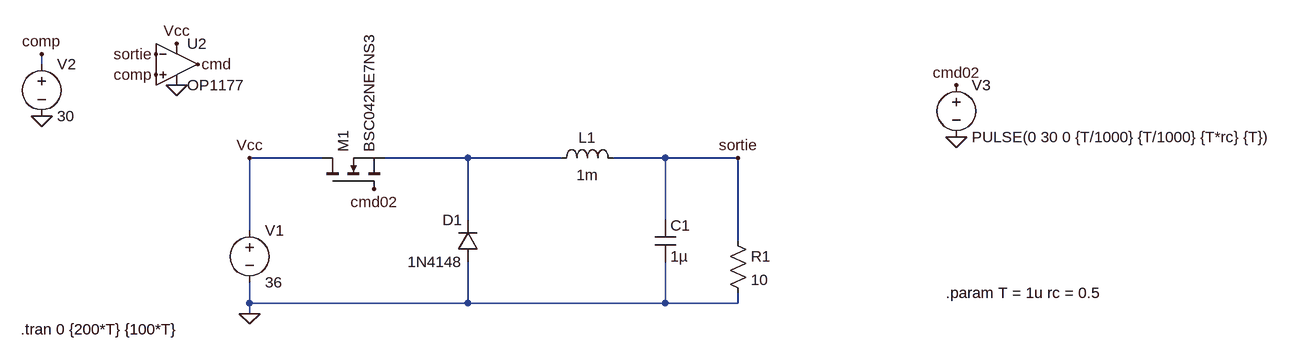
[diagram p0: schematic buckV1.asc]
buckV1.asc, the LTspice schematic file:
Version 4
SHEET 1 1964 680
WIRE -256 -192 -256 -208
WIRE 176 -48 64 -48
WIRE 400 -48 272 -48
WIRE 544 -48 400 -48
WIRE 704 -48 624 -48
WIRE 816 -48 704 -48
WIRE 400 48 400 -48
WIRE 704 48 704 -48
WIRE 64 64 64 -48
WIRE 816 80 816 -48
WIRE 64 176 64 144
WIRE 400 176 400 112
WIRE 400 176 64 176
WIRE 704 176 704 112
WIRE 704 176 400 176
WIRE 816 176 816 160
WIRE 816 176 704 176
WIRE 64 192 64 176
FLAG 64 192 0
FLAG -16 -192 cmd
FLAG 256 0 cmd02
FLAG -80 -208 sortie
FLAG 816 -48 sortie
FLAG 64 -48 Vcc
FLAG -48 -224 Vcc
FLAG -48 -160 0
FLAG -256 -112 0
FLAG -256 -208 comp
FLAG -80 -176 comp
FLAG 1152 -160 cmd02
FLAG 1152 -80 0
SYMBOL voltage 64 48 R0
SYMATTR InstName V1
SYMATTR Value 36
SYMBOL nmos 176 0 R270
SYMATTR InstName M1
SYMATTR Value BSC042NE7NS3
SYMBOL diode 416 112 R180
WINDOW 0 24 64 Left 2
WINDOW 3 24 0 Left 2
SYMATTR InstName D1
SYMATTR Value 1N4148
SYMBOL ind 528 -32 R270
WINDOW 0 32 56 VTop 2
WINDOW 3 5 56 VBottom 2
SYMATTR InstName L1
SYMATTR Value 1m
SYMBOL cap 688 48 R0
SYMATTR InstName C1
SYMATTR Value 1µ
SYMBOL voltage -256 -208 R0
WINDOW 123 0 0 Left 0
WINDOW 39 0 0 Left 0
SYMATTR InstName V2
SYMATTR Value 30
SYMBOL OpAmps\\OP1177 -48 -256 R0
SYMATTR InstName U2
SYMBOL res 800 64 R0
SYMATTR InstName R1
SYMATTR Value 10
SYMBOL voltage 1152 -176 R0
WINDOW 123 0 0 Left 0
WINDOW 39 0 0 Left 0
SYMATTR InstName V3
SYMATTR Value PULSE(0 30 0 {T/1000} {T/1000} {T*rc} {T})
TEXT -288 216 Left 2 !.tran 0 {200*T} {100*T}
TEXT 1136 160 Left 2 !.param T = 1u rc = 0.5

The netlist it stands for:
* buckV1.asc
V1 Vcc 0 36
M1 Vcc cmd02 N001 N001 BSC042NE7NS3
D1 0 N001 1N4148
L1 N001 sortie 1m
C1 sortie 0 1µ
V2 comp 0 30
XU2 comp sortie Vcc 0 cmd OP1177  ; pins In+ In- V+ V- OUT
R1 sortie 0 10
V3 cmd02 0 PULSE(0 30 0 {T/1000} {T/1000} {T*rc} {T})
.model D D
.lib standard.dio
.model NMOS NMOS
.model PMOS PMOS
.lib standard.mos
.tran 0 {200*T} {100*T}
.param T = 1u rc = 0.5
.lib ADI1.lib
.backanno
.end

* Results of the author's LTspice run, read from the files saved beside the schematic
* Operating Point, zero values left out:
*   V(vcc) = 36 V
*   V(comp) = 30 V
*   V(cmd) = 35.25 V
*   Id(M1) = 104.9 pA
*   Is(M1) = -104.9 pA
*   I(L1) = 140.9 pA
*   I(R1) = 2.269 nA
*   I(V2) = 1.914 nA
*   I(V1) = -498.3 µA
*   Ix(u2:1) = -1.914 nA
*   Ix(u2:2) = -2.129 nA
*   Ix(u2:3) = 498.3 µA
*   Ix(u2:4) = -500.1 µA
*   Ix(u2:5) = -34.5 pA
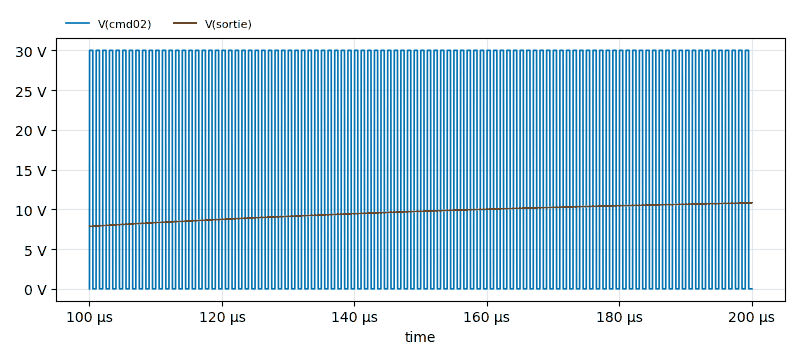
[diagram p1: Transient Analysis of buckV1.asc, plotted from the saved traces]
* Transient Analysis, 1 run:
*   V(cmd02): min 0 V, max 30 V, average 15.03 V, rms 21.23 V, last 0 V
*   V(sortie): min 7.855 V, max 10.81 V, average 9.613 V, rms 9.65 V, last 10.81 V